# Altium schematic sheet Battery Fan Board_March 27.SchDoc
size A4
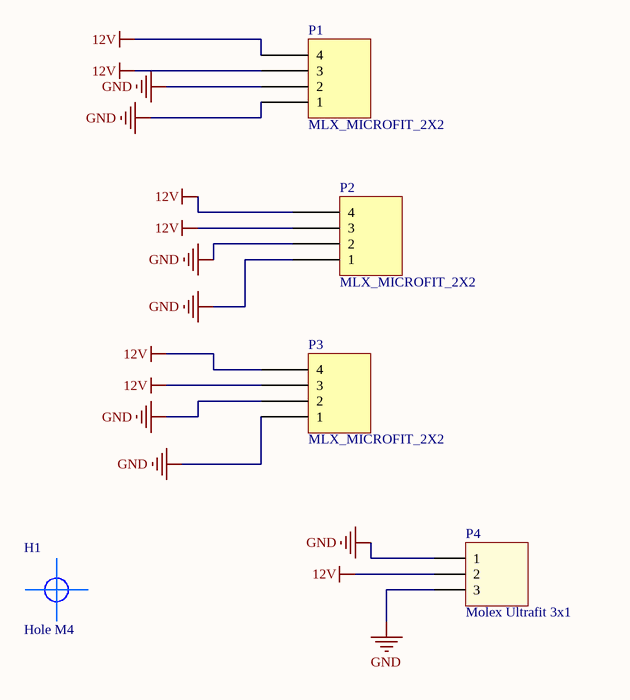
[diagram p0: Battery Fan Board_March 27.SchDoc]

## Parts
H1  Hole M4  [#10Hole]
P1  MLX_MICROFIT_2X2  [MLX_MICROFIT_2X2]
P2  MLX_MICROFIT_2X2  [MLX_MICROFIT_2X2]
P3  MLX_MICROFIT_2X2  [MLX_MICROFIT_2X2]
P4  Molex Ultrafit 3x1  [Molex-Ultrafit-3x1]

## Nets
12V: P1.3 P1.4 P2.3 P2.4 P3.3 P3.4 P4.2
GND: P1.1 P1.2 P2.1 P2.2 P3.1 P3.2 P4.1 P4.3

## Library data of the parts
H1 = #10Hole
P4 = Molex-Ultrafit-3x1: Molex Ultrafit 3x1 - 172310-1303